# EasyEDA schematic 3 HF Upconverter (TH)_ Crystall.json
TITLE: HF Upconverter (TH): Crystall; REV: 3.4.EE; Date: 2018-03-02; Sheet: 1/1; Drawn By: IgrikXD
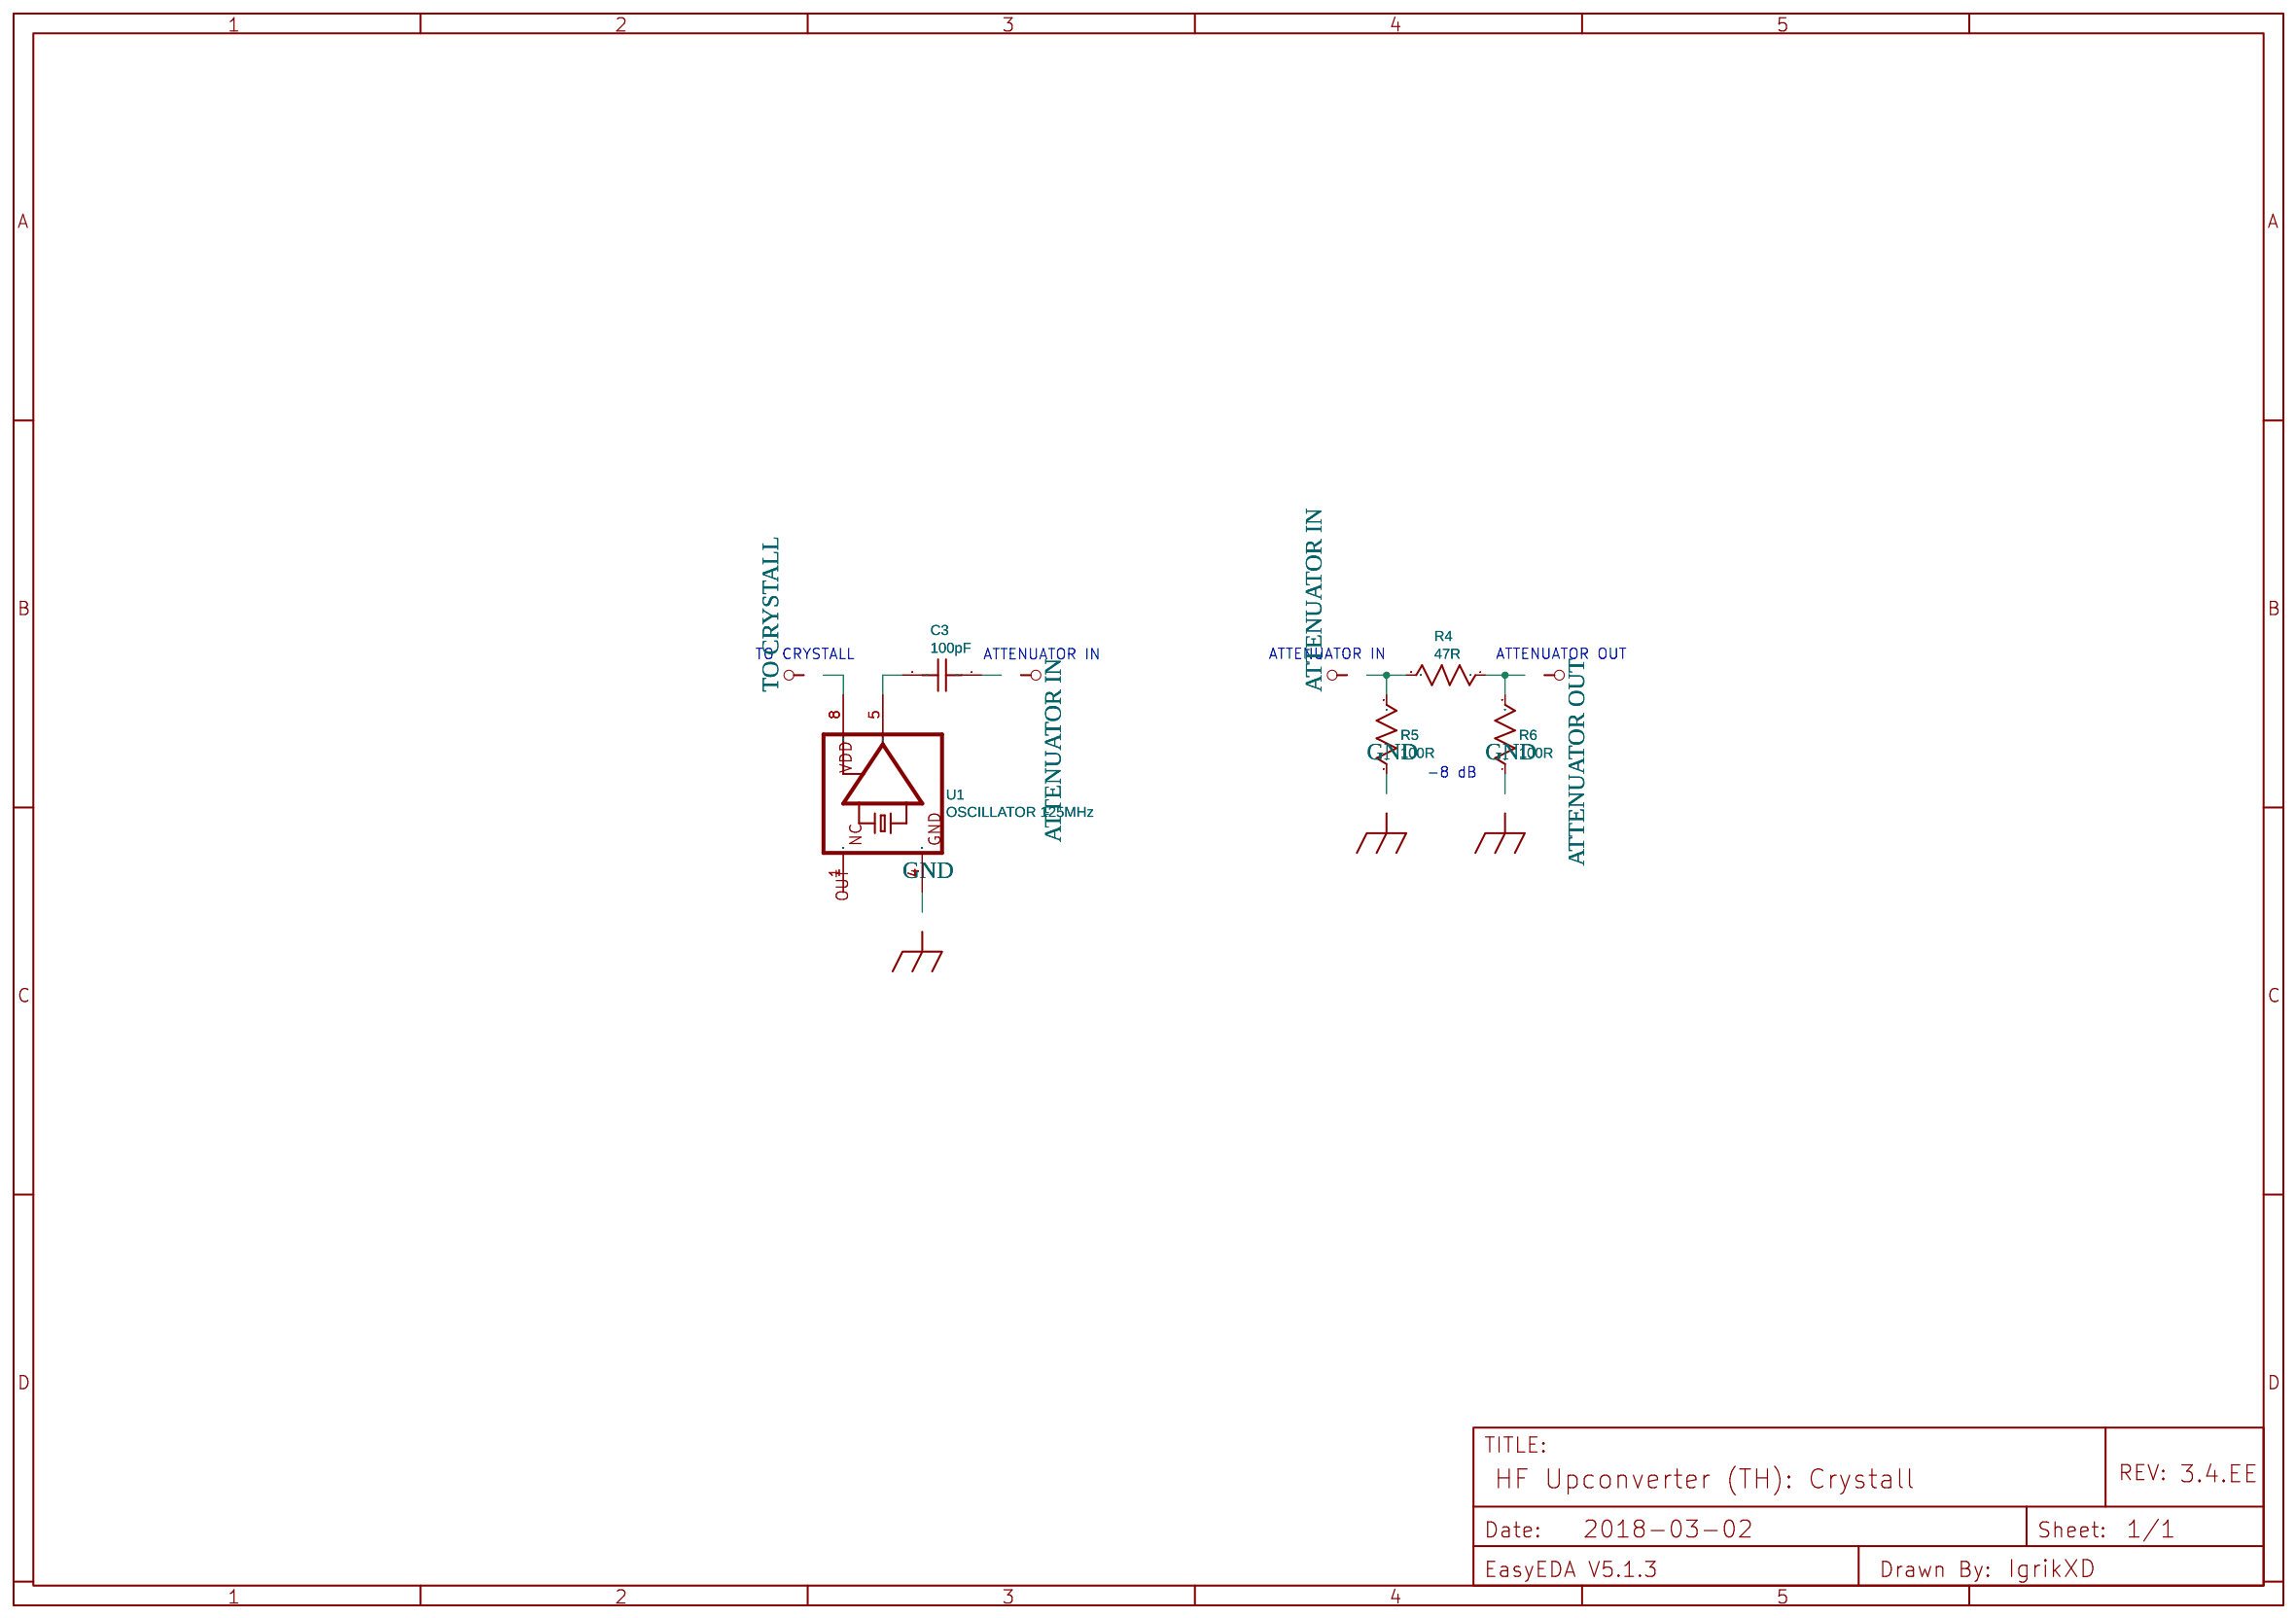
[diagram p0: schematic sheet]

## Parts
C3  100pF  [RAD-0.2]
R4  47R  [AXIAL-0.3]
R5  100R  [AXIAL-0.3]
R6  100R  [AXIAL-0.3]
U1  OSCILLATOR 125MHz  [CRYSTAL-OSCILLATOR]

## Library data of the parts
C3 = Capacitor: Manufacturer Part: CC4-0805-CG -50V-100pF-J; Supplier: LCSC; LCSC: C123146; Manufacturer: TORCH
R4 = Resistor: Manufacturer Part: MF1/4W-47Ω±1% T52; Supplier: LCSC; LCSC: C119296; Manufacturer: CCO
R5 R6 = Resistor: Manufacturer Part: MF1/4W-100Ω±1% T52; Supplier: LCSC; LCSC: C119304; Manufacturer: CCO
U1 = -: catid: 20; Manufacturer Part: CPPC4L-A7BR-125.0TS; Supplier: Digi-Key; Digi-Key: CPPC4L-A7BR-125.0TS-ND; Manufacturer: Cardinal Components Inc.

## Nets
GND: R5.1 R6.1 U1.4(VSS)
ATTENUATOR IN: C3.1 R4.2 R5.2
ATTENUATOR OUT: R4.1 R6.2
TO CRYSTALL: U1.8(CON)
Net-(C3-2): C3.2 U1.5(OUT)

Not connected (* = marked no-connect by the designer): U1 1(VDD)

## Notes on the sheet
- TO CRYSTALL
- ATTENUATOR IN
- ATTENUATOR IN
- ATTENUATOR OUT
- -8 dB
